# Altium schematic sheet P08 PHY 3.SchDoc
size 420 x 297 mm
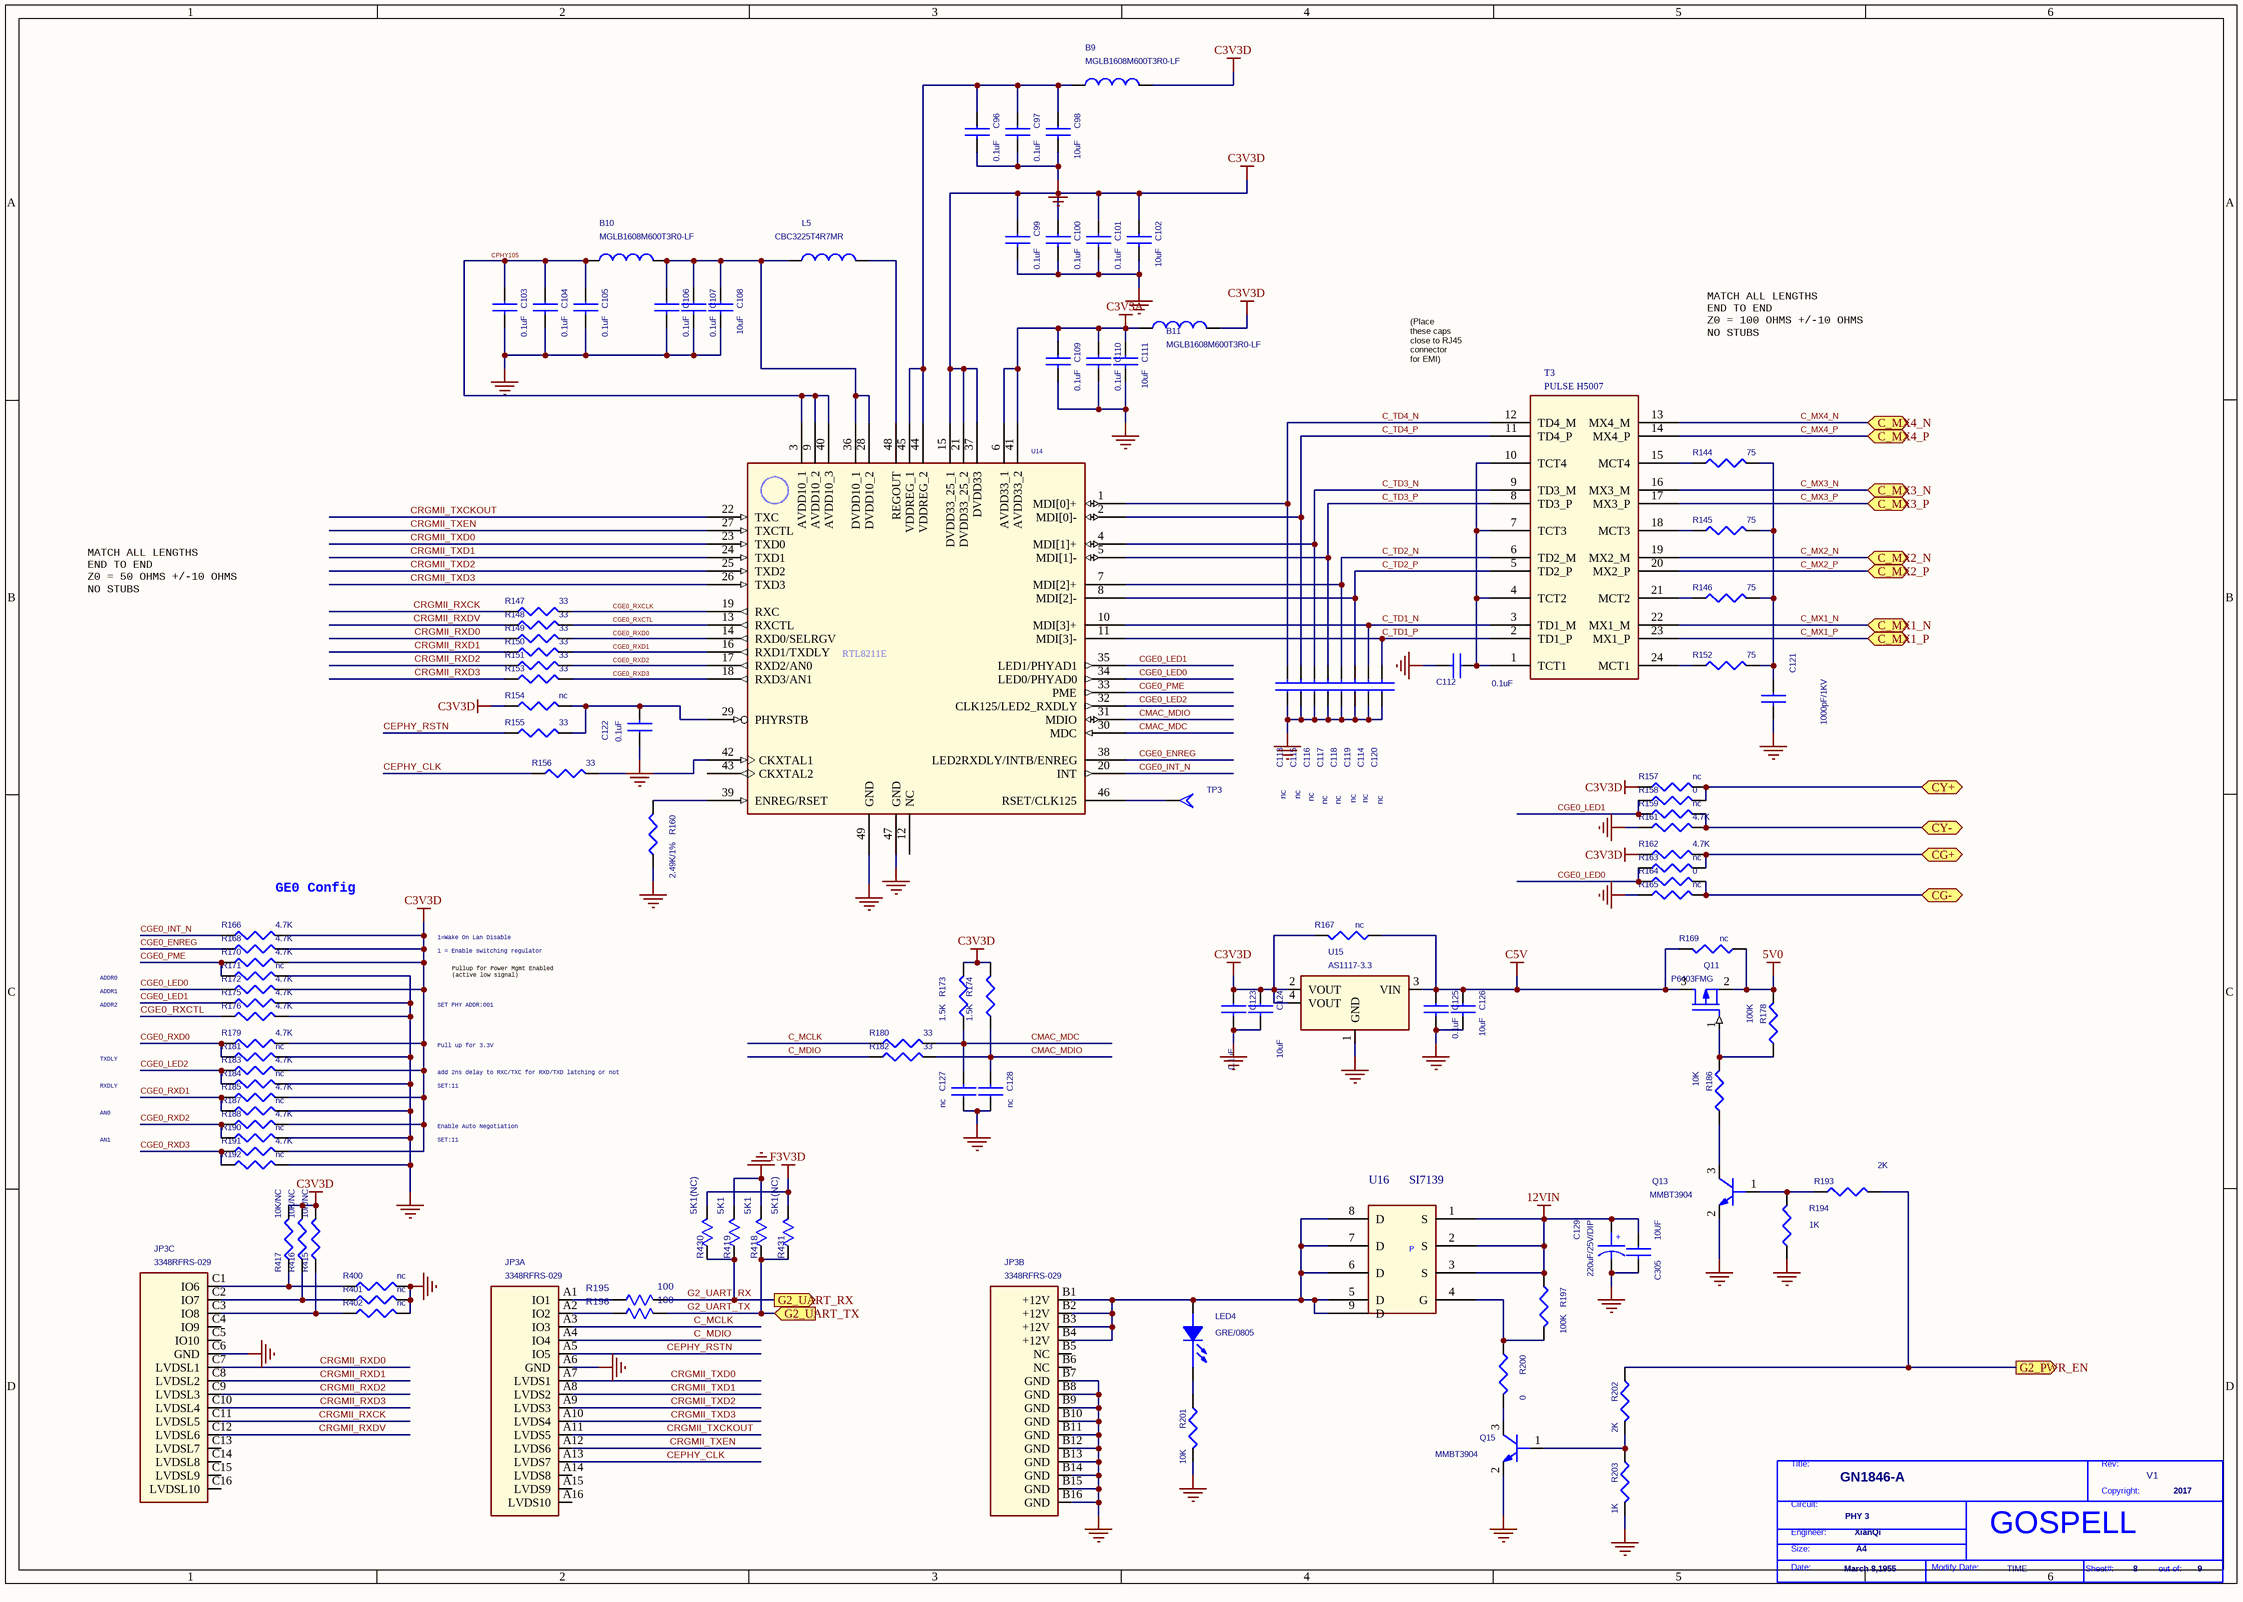
[diagram p0: P08 PHY 3.SchDoc]

## Parts
*  Doc: PHY 3  Page Count: 9  Page Number: 8  Page Create Date: March 8,1955  Page Size: A4  RevCode: V1  Title: GN1846-A  Copyright: 2017  Engineer: XianQi  Page Modify Date: TIME  (hidden comment: GOSPELL)  (graphical)
B9  MGLB1608M600T3R0-LF  [L0603]
B10  MGLB1608M600T3R0-LF  [L0603]
B11  MGLB1608M600T3R0-LF  [L0603]
C96  0.1uF  [0402C]
C97  0.1uF  [0402C]
C98  10uF  [C0603]
C99  0.1uF  [0402C]
C100  0.1uF  [0402C]
C101  0.1uF  [0402C]
C102  10uF  [C0603]
C103  0.1uF  [0402C]
C104  0.1uF  [0402C]
C105  0.1uF  [0402C]
C106  0.1uF  [0402C]
C107  0.1uF  [0402C]
C108  10uF  [C0603]
C109  0.1uF  [0402C]
C110  0.1uF  [0402C]
C111  10uF  [C0603]
C112  0.1uF  [0402C]
C113  nc  [0402C]
C114  nc  [0402C]
C115  nc  [0402C]
C116  nc  [0402C]
C117  nc  [0402C]
C118  nc  [0402C]
C119  nc  [0402C]
C120  nc  [0402C]
C121  1000pF/1KV  [C1206]
C122  0.1uF  [0402C]
C123  0.1uF  [0402C]
C124  10uF  [C0603]
C125  0.1uF  [0402C]
C126  10uF  [C0603]
C127  nc  [0402C]
C128  nc  [0402C]
C129  220uF/25V/DIP  [CE8X3.5]
C305  10UF  [C1206]
JP3  3348RFRS-029  [3348RFRS-029]  (parts A,B,C of 3)
L5  CBC3225T4R7MR  [FB0805]
LED4  GRE/0805  [LED0805]
Q11  P6403FMG  [SOT23]
Q13  MMBT3904  [SOT23]
Q15  MMBT3904  [SOT23]
R144  75  [0402R]
R145  75  [0402R]
R146  75  [0402R]
R147  33  [0402R]
R148  33  [0402R]
R149  33  [0402R]
R150  33  [0402R]
R151  33  [0402R]
R152  75  [0402R]
R153  33  [0402R]
R154  nc  [0402R]
R155  33  [0402R]
R156  33  [0402R]
R157  nc  [0402R]
R158  0  [0402R]
R159  nc  [0402R]
R160  2.49K/1%  [0402R]
R161  4.7K  [0402R]
R162  4.7K  [0402R]
R163  nc  [0402R]
R164  0  [0402R]
R165  nc  [0402R]
R166  4.7K  [0402R]
R167  nc  [R0603]
R168  4.7K  [0402R]
R169  nc  [R0603]
R170  4.7K  [0402R]
R171  nc  [0402R]
R172  4.7K  [0402R]
R173  1.5K  [0402R]
R174  1.5K  [0402R]
R175  4.7K  [0402R]
R176  4.7K  [0402R]
R178  100K  [0402R]
R179  4.7K  [0402R]
R180  33  [0402R]
R181  nc  [0402R]
R182  33  [0402R]
R183  4.7K  [0402R]
R184  nc  [0402R]
R185  4.7K  [0402R]
R186  10K  [0402R]
R187  nc  [0402R]
R188  4.7K  [0402R]
R190  nc  [0402R]
R191  4.7K  [0402R]
R192  nc  [0402R]
R193  2K  [0402R]
R194  1K  [0402R]
R195  100  [0402R]
R196  100  [0402R]
R197  100K  [R0603]
R200  0  [0402R]
R201  10K  [0402R]
R202  2K  [0402R]
R203  1K  [0402R]
R400  nc  [0402R]
R401  nc  [0402R]
R402  nc  [0402R]
R415  10K/NC  [0402R]
R416  10K/NC  [0402R]
R417  10K/NC  [0402R]
R418  5K1  [0402R]
R419  5K1  [0402R]
R430  5K1(NC)  [0402R]
R431  5K1(NC)  [0402R]
T3  PULSE H5007  [H5007-H]
TP3  T POINT A  [TP_G]  (value not drawn)
U14  RTL8211D  [QFN-48P-RTL8211]  (value not drawn)
U15  AS1117-3.3  [SOT223]
U16  SI7139  [PowerPAKSO8]

## Ports
C_MX1_N (bidir), C_MX1_P (bidir), C_MX2_N (bidir), C_MX2_P (bidir), C_MX3_N (bidir), C_MX3_P (bidir), C_MX4_N (bidir), C_MX4_P (bidir), CG+ (bidir), CG- (bidir), CY+ (bidir), CY- (bidir), G2_PWR_EN (out), G2_UART_RX (out), G2_UART_TX (in)

## Nets
5V0: Q11.2(SOURCE) R169.2 R178.1
12VIN: C129.1 C305.1 R197.2 U16.1(S) U16.2(S) U16.3(S)
C3V3A: B11.1 C109.1 C110.1 C111.1 U14.6(AVDD33_1) U14.41(AVDD33_2)
C3V3D: B9.2 B11.2 C99.1 C100.1 C101.1 C102.1 C123.1 C124.1 R154.1 R157.1 R162.1 R166.2 R167.1 R168.2 R170.2 R172.2 R173.2 R174.2 R179.2 R183.2 R185.2 R188.2 R191.2 R415.2 R416.2 R417.2 U14.15(DVDD33_25_1) U14.21(DVDD33_25_2) U14.37(DVDD33) U15.2(VOUT) U15.4(VOUT)
C5V: C125.1 C126.1 Q11.3(DRAIN) R167.2 R169.1 U15.3(VIN)
F3V3D: R430.2(B) R431.2(B)
GND: C96.2 C97.2 C98.2 C99.2 C100.2 C101.2 C102.2 C103.2 C104.2 C105.2 C106.2 C107.2 C108.2 C109.2 C110.2 C111.2 C112.2 C113.1 C114.1 C115.1 C116.1 C117.1 C118.1 C119.1 C120.1 C121.2 C122.1 C123.2 C124.2 C125.2 C126.2 C127.1 C128.1 C129.2 C305.2 JP3.A6(GND) JP3.B7(GND) JP3.B8(GND) JP3.B9(GND) JP3.B10(GND) JP3.B11(GND) JP3.B12(GND) JP3.B13(GND) JP3.B14(GND) JP3.B15(GND) JP3.B16(GND) JP3.C6(GND) Q13.2(EMITTER) Q15.2(EMITTER) R160.1 R161.1 R165.1 R171.2 R175.2 R176.2 R181.2 R184.2 R187.2 R190.2 R192.2 R194.1 R201.1 R203.1 R400.2 R401.2 R402.2 R418.2(B) R419.2(B) U14.47(GND) U14.49(GND) U15.1(GND)
C_MCLK: JP3.A3(IO3) R180.1
C_MDIO: JP3.A4(IO4) R182.1
C_MX1_N: T3.22(MX1_M) ; port C_MX1_N
C_MX1_P: T3.23(MX1_P) ; port C_MX1_P
C_MX2_N: T3.19(MX2_M) ; port C_MX2_N
C_MX2_P: T3.20(MX2_P) ; port C_MX2_P
C_MX3_N: T3.16(MX3_M) ; port C_MX3_N
C_MX3_P: T3.17(MX3_P) ; port C_MX3_P
C_MX4_N: T3.13(MX4_M) ; port C_MX4_N
C_MX4_P: T3.14(MX4_P) ; port C_MX4_P
C_TD1_N: C114.2 T3.3(TD1_M) U14.10(MDI[3]+)
C_TD1_P: C120.2 T3.2(TD1_P) U14.11(MDI[3]-)
C_TD2_N: C118.2 T3.6(TD2_M) U14.7(MDI[2]+)
C_TD2_P: C119.2 T3.5(TD2_P) U14.8(MDI[2]-)
C_TD3_N: C116.2 T3.9(TD3_M) U14.4(MDI[1]+)
C_TD3_P: C117.2 T3.8(TD3_P) U14.5(MDI[1]-)
C_TD4_N: C113.2 T3.12(TD4_M) U14.1(MDI[0]+)
C_TD4_P: C115.2 T3.11(TD4_P) U14.2(MDI[0]-)
CEPHY_CLK: JP3.A13(LVDS7) R156.1
CEPHY_RSTN: JP3.A5(IO5) R155.1
CG+: R162.2 R163.2 ; port CG+
CG-: R164.2 R165.2 ; port CG-
CGE0_ENREG: R168.1 U14.38(LED2RXDLY/INTB/ENREG)
CGE0_INT_N: R166.1 U14.20(INT)
CGE0_LED0: R163.1 R164.1 R172.1 U14.34(LED0/PHYAD0)
CGE0_LED1: R158.1 R159.1 R175.1 U14.35(LED1/PHYAD1)
CGE0_LED2: R183.1 R184.1 U14.32(CLK125/LED2_RXDLY)
CGE0_PME: R170.1 R171.1 U14.33(PME)
CGE0_RXCLK: R147.2 U14.19(RXC)
CGE0_RXCTL: R148.2 R176.1 U14.13(RXCTL)
CGE0_RXD0: R149.2 R179.1 R181.1 U14.14(RXD0/SELRGV)
CGE0_RXD1: R150.2 R185.1 R187.1 U14.16(RXD1/TXDLY)
CGE0_RXD2: R151.2 R188.1 R190.1 U14.17(RXD2/AN0)
CGE0_RXD3: R153.2 R191.1 R192.1 U14.18(RXD3/AN1)
CMAC_MDC: C127.2 R173.1 R180.2 U14.30(MDC)
CMAC_MDIO: C128.2 R174.1 R182.2 U14.31(MDIO)
CPHY105: B10.1 C103.1 C104.1 C105.1 U14.3(AVDD10_1) U14.9(AVDD10_2) U14.40(AVDD10_3)
CRGMII_RXCK: JP3.C11(LVDSL5) R147.1
CRGMII_RXD0: JP3.C7(LVDSL1) R149.1
CRGMII_RXD1: JP3.C8(LVDSL2) R150.1
CRGMII_RXD2: JP3.C9(LVDSL3) R151.1
CRGMII_RXD3: JP3.C10(LVDSL4) R153.1
CRGMII_RXDV: JP3.C12(LVDSL6) R148.1
CRGMII_TXCKOUT: JP3.A11(LVDS5) U14.22(TXC)
CRGMII_TXD0: JP3.A7(LVDS1) U14.23(TXD0)
CRGMII_TXD1: JP3.A8(LVDS2) U14.24(TXD1)
CRGMII_TXD2: JP3.A9(LVDS3) U14.25(TXD2)
CRGMII_TXD3: JP3.A10(LVDS4) U14.26(TXD3)
CRGMII_TXEN: JP3.A12(LVDS6) U14.27(TXCTL)
CY+: R157.2 R158.2 ; port CY+
CY-: R159.2 R161.2 ; port CY-
G2_PWR_EN: R193.2 R202.2 ; port G2_PWR_EN
G2_UART_RX: R195.2(B) R419.1(A) R430.1(A) ; port G2_UART_RX
G2_UART_TX: R196.2(B) R418.1(A) R431.1(A) ; port G2_UART_TX
NetB9_1: B9.1 C96.1 C97.1 C98.1 U14.44(VDDREG_2) U14.45(VDDREG_1)
NetB10_2: B10.2 C106.1 C107.1 C108.1 L5.1 U14.28(DVDD10_2) U14.36(DVDD10_1)
NetC112_1: C112.1 T3.1(TCT1) T3.4(TCT2) T3.7(TCT3) T3.10(TCT4)
NetC121_1: C121.1 R144.2 R145.2 R146.2 R152.2
NetC122_2: C122.2 R154.2 R155.2 U14.29(PHYRSTB)
NetJP3_A1: JP3.A1(IO1) R195.1(A)
NetJP3_A2: JP3.A2(IO2) R196.1(A)
NetJP3_B1: JP3.B1(+12V) JP3.B2(+12V) JP3.B3(+12V) JP3.B4(+12V) LED4.A(ANODE) U16.5(D) U16.6(D) U16.7(D) U16.8(D) U16.9(D)
NetJP3_C1: JP3.C1(IO6) R400.1 R417.1
NetJP3_C2: JP3.C2(IO7) R401.1 R416.1
NetJP3_C3: JP3.C3(IO8) R402.1 R415.1
NetL5_2: L5.2 U14.48(REGOUT)
NetLED4_K: LED4.K(CATHODE) R201.2
NetQ11_1: Q11.1(GATE) R178.2 R186.1
NetQ13_1: Q13.1(BASE) R193.1 R194.2
NetQ13_3: Q13.3(COLLECTOR) R186.2
NetQ15_1: Q15.1(BASE) R202.1 R203.2
NetQ15_3: Q15.3(COLLECTOR) R200.1
NetR144_1: R144.1 T3.15(MCT4)
NetR145_1: R145.1 T3.18(MCT3)
NetR146_1: R146.1 T3.21(MCT2)
NetR152_1: R152.1 T3.24(MCT1)
NetR156_2: R156.2 U14.42(CKXTAL1)
NetR160_2: R160.2 U14.39(ENREG/RSET)
NetR197_1: R197.1 R200.2 U16.4(G)
NetTP3_1: TP3.1(TP) U14.46(RSET/CLK125)

Not connected (* = marked no-connect by the designer): JP3 A14(LVDS8) A15(LVDS9) A16(LVDS10) B5(NC) B6(NC) C4(IO9) C5(IO10) C13(LVDSL7) C14(LVDSL8) C15(LVDSL9) C16(LVDSL10); U14 12(NC) 43(CKXTAL2)

## Notes on the sheet
- (Place
  these caps
  close to RJ45
  connector
  for EMI)
- MATCH ALL LENGTHS
  END TO END
  Z0 = 100 OHMS +/-10 OHMS
  NO STUBS
- MATCH ALL LENGTHS
  END TO END
  Z0 = 50 OHMS +/-10 OHMS
  NO STUBS
- GE0 Config
- 1=Wake On Lan Disable
- ADDR0
- ADDR1
- 1 = Enable switching regulator
- Pullup for Power Mgmt Enabled
  (active low signal)
- ADDR2
- TXDLY
- SET PHY ADDR:001
- Pull up for 3.3V
- add 2ns delay to RXC/TXC for RXD/TXD latching or not
- AN0
- RXDLY
- Enable Auto Negotiation
- SET:11
- AN1
- (in symbol CAP POL) +
- (in symbol GOSPELL) Title:; Rev:; Copyright:; Circuit:; Engineer:; Size:; Date:; Modify Date:; Sheet#:; out of:
- (in symbol RTL8211D_1) RTL8211E
- (in symbol SI7139) P

## Library data of the parts
B9-B11 L5 = CHOKE TORROID_0
C96-C128 = CAP NP_Dup1
C129 = CAP POL
C305 = CAP NP
LED4 = LED_0
Q11 = MOSFET P_0
Q13 Q15 = 2N3904
R144-R166 R168 R170-R176 R179-R185 R187 R188 R190-R192 R197 R200-R203 R400-R402 R415-R417 = R_Dup1
R167 R169 R178 R186 R193 R194 = R
R195 R196 R418 R419 R430 R431 = R_1: PARTS: 1; OriginalSymbolOrigin: (10,20); PINSWAP: (A,B); DEVICE: RK73H1JTTD7502F; PKG_TYPE: SR0603; LEVEL: STD; %208%%161%%192%%224%%195%%251%%179%%198%: 片式厚膜电阻器; COMPONENT_HIGH_MAX: 0.55MM; %215%%232%%214%%181%%212%%202%%208%%237%%198%%171%%178%%238%: +/-1%; %182%%238%%182%%168%%185%%166%%194%%202%(W): 0.1; %195%%232%%202%%246%: 片式厚膜电阻器-0.1W-75000OHM-+/-1%-0603; CODE: 7091238
T3 = PULSE H5007_0
U14 = RTL8211D_1
U15 = AS1117-X_2
* = GOSPELL: Cage Code: 2017; Schematic Page Count: 9; Schematic Page Number: 8